# EAGLE design C4H_LightGate_Eyes (EAGLE 9.1.2)
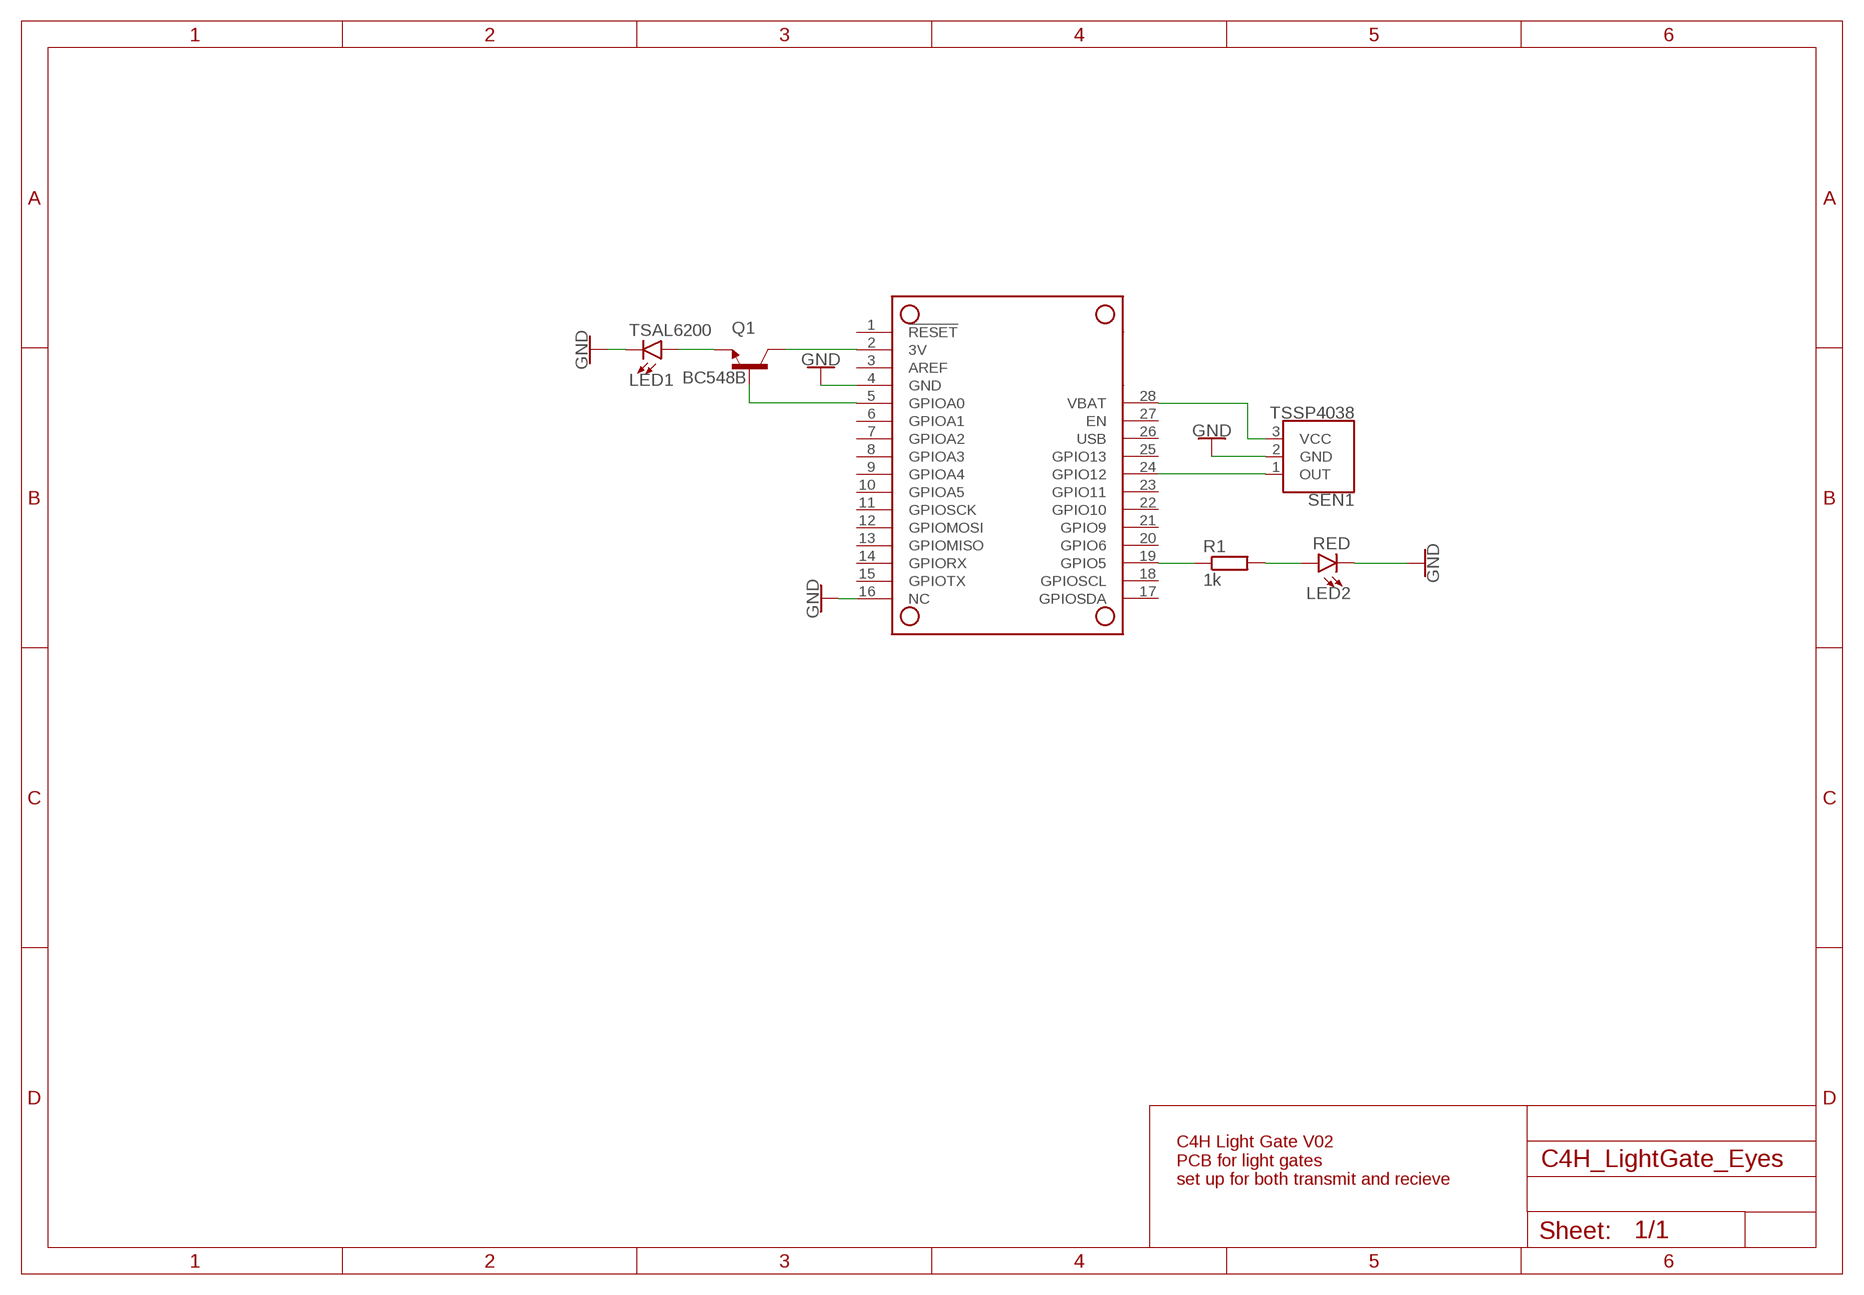
[diagram p0: schematic, sheet 1]

## Parts
LED1  TSAL6200  IR-LEDIR_LED_5MM  [LED5MM]
LED2  RED  LED-5MMIR_LED_5MM  [LED5MM]
MS1  FEATHERWING  [FEATHERWING]
Q1  BC548B  [TO92-EBC]
R1  1k  1/4W_0207  [0207/7]
SEN1  TSSP4038  TSSP40RA  [TSSP40]

## Nets
3V: MS1.2(3V) Q1.C
GND: LED1.K(C) LED2.K(C) MS1.4(GND) MS1.16(NC) SEN1.2(GND)
N$1: LED1.A Q1.E
N$2: MS1.5(GPIOA0) Q1.B
N$4: MS1.19(GPIO5) R1.1
N$5: LED2.A R1.2
N$7: MS1.24(GPIO12) SEN1.1(OUT)
VBAT: MS1.28(VBAT) SEN1.3(VCC)
Unconnected: MS1.1(!RESET) MS1.3(AREF) MS1.6(GPIOA1) MS1.7(GPIOA2) MS1.8(GPIOA3) MS1.9(GPIOA4) MS1.10(GPIOA5) MS1.11(GPIOSCK) MS1.12(GPIOMOSI) MS1.13(GPIOMISO) MS1.14(GPIORX) MS1.15(GPIOTX) MS1.17(GPIOSDA) MS1.18(GPIOSCL) MS1.20(GPIO6) MS1.21(GPIO9) MS1.22(GPIO10) MS1.23(GPIO11) MS1.25(GPIO13) MS1.26(USB) MS1.27(EN)

## Library data of the parts
LED1 = C4HLightGate:IR-LED: IR LED 5mm PTH 5 mm, round Specifications: Pin count: 2 Pin pitch: 0.1inch Diameter: 5mm Example device(s): LED-IR-THRU
LED2 = C4HLightGate:LED-5MM: IR LED 5mm PTH 5 mm, round Specifications: Pin count: 2 Pin pitch: 0.1inch Diameter: 5mm Example device(s): LED-IR-THRU
MS1 = C4HLightGate:FEATHERWING
Q1 = C4HLightGate:BC548*: NPN Transistor
R1 = C4HLightGate:1/4W_0207: RESISTOR 1/4W TH type 0207, grid 7.5 mm
SEN1 = C4HLightGate:TSSP40: TSSP40 IR Receiver Module 2.5V/5.5V IR Receiver with Low Power Consumption, High-immunity Against Ambient Light. Datasheet <https://www.vishay.com/docs/82458/tssp40.pdf>; PROD_ID: COMP-12059

## Board
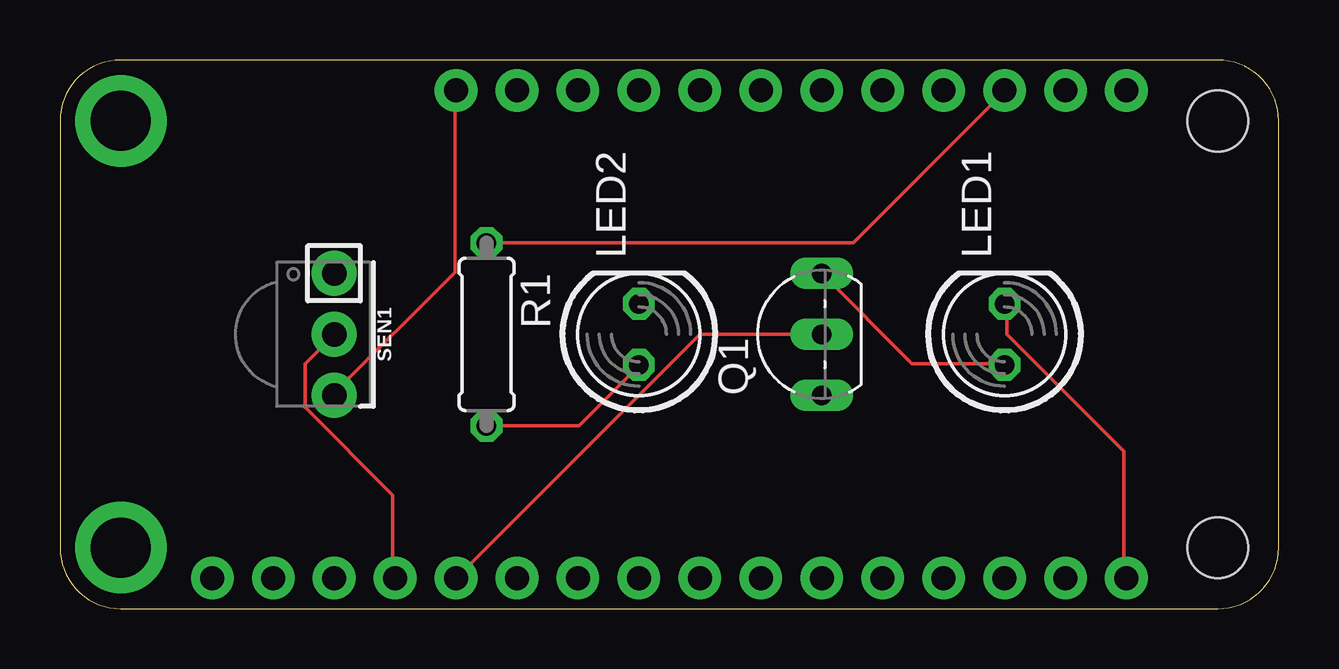
[diagram p1: board, top side]
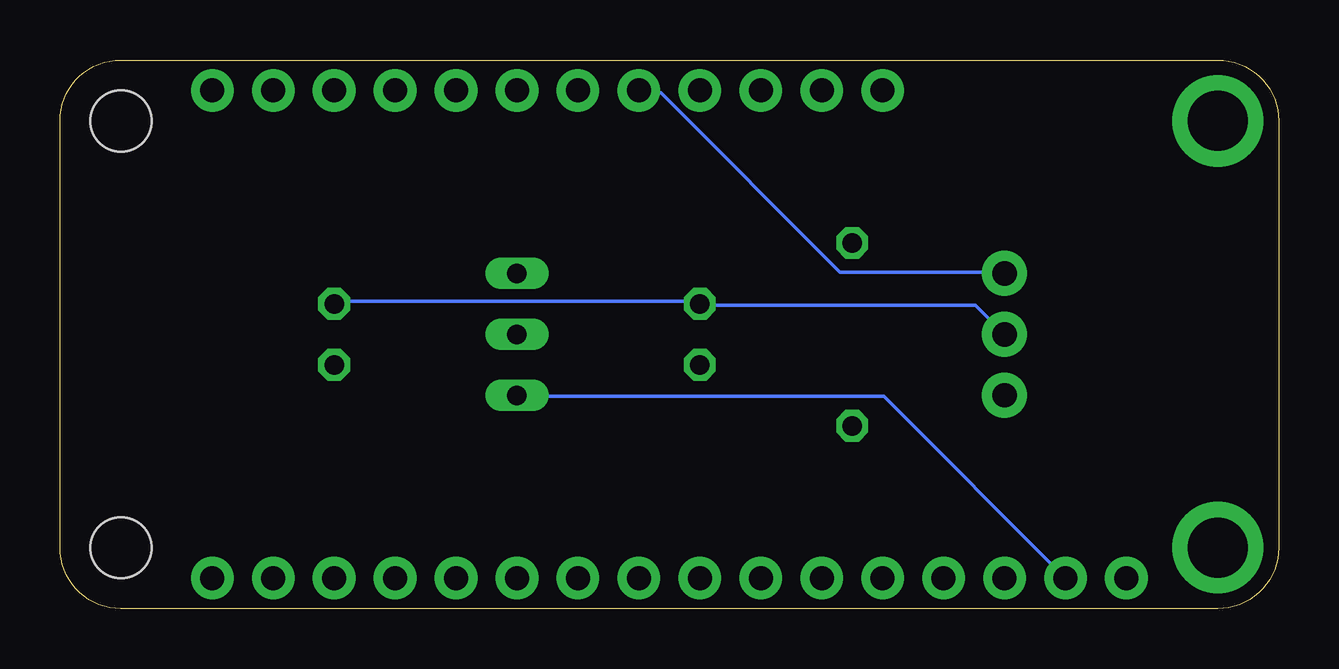
[diagram p2: board, bottom side, seen from below]

Size 50.8 x 22.86 mm. Coordinates in mm from the lower left corner, seen from the top.
Copper layers (1*16): Top 0.035mm / dielectric 1.5mm / Bottom 0.035mm
Design rules "default": minimum track width 6mil, minimum drill 0.35mm, track to track 6mil, track to pad 6mil, pad to pad 6mil, via to via 6mil, smd to smd 6mil, copper to edge 40mil, drill to drill 6mil, minimum pad ring 10mil, minimum via ring 8mil, stop-mask expansion 4mil, vias tented up to drill 0mil, thermal gap 10mil

### Footprints (pad centres in the part's own frame; a part is rotated, then mirrored left to right if it is on the bottom)
LED5MM = drill 0.813 octagon: A -1.27,0; K 1.27,0
FEATHERWING = drill 1 pad 1.778: 1 6.35,1.27; 2 8.89,1.27; 3 11.43,1.27; 4 13.97,1.27; 5 16.51,1.27; 6 19.05,1.27; 7 21.59,1.27; 8 24.13,1.27; 9 26.67,1.27; 10 29.21,1.27; 11 31.75,1.27; 12 34.29,1.27; 13 36.83,1.27; 14 39.37,1.27; 15 41.91,1.27; 16 44.45,1.27; 17 44.45,21.59; 18 41.91,21.59; 19 39.37,21.59; 20 36.83,21.59; 21 34.29,21.59; 22 31.75,21.59; 23 29.21,21.59; 24 26.67,21.59; 25 24.13,21.59; 26 21.59,21.59; 27 19.05,21.59; 28 16.51,21.59 | drill 2.5 pad 3.81: P$1 2.54,20.32; P$2 2.54,2.54 | hole 2.54: 48.26,20.32; 48.26,2.54
TO92-EBC = drill 0.813 long: B 0,-1.27; C -2.54,-1.27; E 2.54,-1.27
0207/7 = drill 0.813 octagon: 1 -3.81,0; 2 3.81,0
TSSP40 = drill 1.016 pad 1.88: 1 -2.54,0; 2 0,0; 3 2.54,0

### Placement (x,y rotation side)
LED1  39.37,11.43 90 top
LED2  24.13,11.43 90 top
MS1  0,0 0 top
Q1  30.48,11.43 90 top
R1  17.78,11.43 270 top
SEN1  11.43,11.43 270 top

### Tracks (layer width: path | path; a pad name or v marks a point on that pad's centre or on a via)
3V
  Bottom 0.152: MS1.2 16.46,8.84 31.7,8.84 Q1.C
GND
  Top 0.152: LED1.K 39.47,12.65 39.47,11.43 44.35,6.55 44.35,1.37 MS1.16 | SEN1.2 10.21,10.21 10.21,8.38 13.87,4.72 13.87,1.37 MS1.4
  Bottom 0.152: SEN1.2 12.65,12.65 24.08,12.65 LED2.K 24.23,12.8 39.32,12.8 LED1.K
N$1
  Top 0.152: Q1.E 35.51,10.21 39.32,10.21 LED1.A
N$2
  Top 0.152: Q1.B 26.67,11.43 MS1.5
N$4
  Top 0.152: R1.1 33.07,15.24 39.32,21.49 MS1.19
N$5
  Top 0.152: R1.2 21.64,7.62 24.08,10.06 LED2.A
N$7
  Bottom 0.152: MS1.24 26.67,21.49 25.76,21.49 18.29,14.02 11.43,14.02 SEN1.1
VBAT
  Top 0.152: MS1.28 16.46,21.49 16.46,14.02 11.43,8.99 SEN1.3